# Altium schematic sheet DC Step-Down Converter.SchDoc
size A4; Organization: Machine Intelligence Laboratory; SheetNumber: 4; SheetTotal: 4; Des1: This steps down the ~22V; Des2: from the battery to 5V for use; Des3: with PCB electronics.; Author1: Russell MacGregor; VersionControl_Repository: BatteryMonitorSpring2025
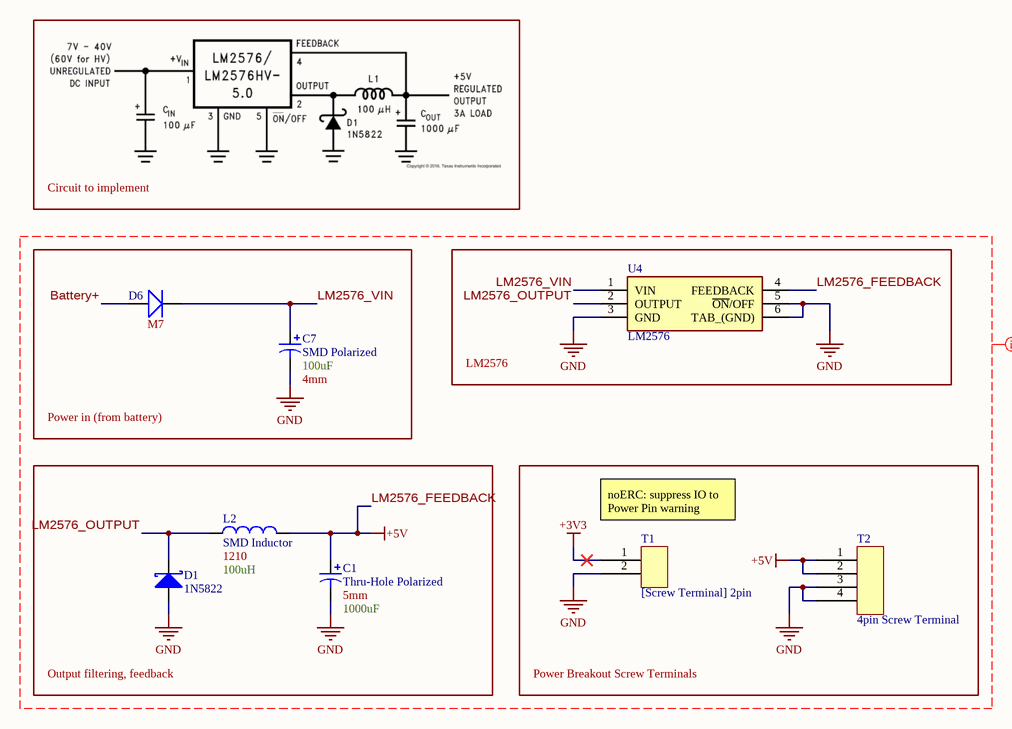
[diagram p0: DC Step-Down Converter.SchDoc]

## Parts
C1  Thru-Hole Polarized  Pin Spacing: 5mm  Capacitance: 1000uF  [[Cap] Thru-Hole Polarized 5mm]
C7  SMD Polarized  Capacitance: 100uF  Diameter: 4mm  [[Cap] SMD Polarized, 4mm]
D1  1N5822  [[Diode] Thru-Hole Schottky]
D6  Size Package: M7  [[Diode] SMD M7]  (hidden comment: Rectifier)
L2  SMD Inductor  Size Package: 1210  Inductance: 100uH  [[Inductor] SMD 1210]
T1  [Screw Terminal] 2pin  [[Screw Terminal] 2pin]
T2  4pin Screw Terminal  [[Screw Terminal] 4pin]
U4  LM2576  [[IC] Buck Converter]

## Blocks framed on the sheet
Power in (from battery): C7 D6
LM2576: U4
Output filtering, feedback: C1 D1 L2
Power Breakout Screw Terminals: T1 T2

## Nets
+3V3: T1.1
GND: C1.2 C7.2 D1.2(A) T1.2 T2.3 T2.4 U4.3(GND) U4.5(~{ON}/OFF) U4.6(TAB_(GND))
LM2576_FEEDBACK: C1.1 L2.2 T2.1 T2.2 U4.4(FEEDBACK)  [also labelled +5V]
Battery+: D6.2(Anode)
LM2576_OUTPUT: D1.1(K) L2.1 U4.2(OUTPUT)
LM2576_VIN: C7.1 D6.1(Cathode) U4.1(VIN)

## Layout directives
net class Supply_Nets: +3V3, +5V, Battery+, GND, LM2576_FEEDBACK, LM2576_OUTPUT, LM2576_VIN

## Notes on the sheet
- Circuit to implement
- (near T1) noERC: suppress IO to Power Pin warning
- Project/Vehicle:
- Author(s):
- -
- Revisor(s):
- Git Repo:
- Git Hash:
- Date:
- Revision:
- Size:
- A4
- File:
- Sheet
- of

## Library data of the parts
C1 = [Cap] Thru-Hole Polarized: JLC Part #: *; Mouser Part #: *
C7 = [Cap] SMD Polarized: JLC Part #: *; Mouser Part #: *
D1 = [Diode] Thru-Hole Schottky: Mouser Part #: 511-1N5822
D6 = [Diode] SMD Rectifier: Generic; Mouser Part #: *
L2 = [Inductor] SMD Inductor: JLC Part #: *; Mouser Part #: *
T2 = [Screw Terminal] 4pin
U4 = [IC] Buck Converter